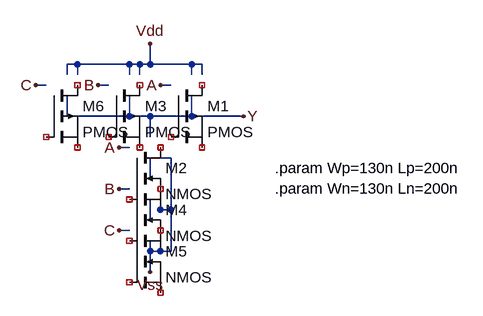
[diagram p0: schematic nand3.asc]
nand3.asc, the LTspice schematic file:
Version 4
SHEET 1 880 680
WIRE -272 -304 -288 -304
WIRE -192 -304 -272 -304
WIRE -176 -304 -192 -304
WIRE -160 -304 -160 -336
WIRE -160 -304 -176 -304
WIRE -96 -304 -160 -304
WIRE -80 -304 -96 -304
WIRE -288 -288 -288 -304
WIRE -272 -288 -272 -304
WIRE -192 -288 -192 -304
WIRE -176 -288 -176 -304
WIRE -96 -288 -96 -304
WIRE -80 -288 -80 -304
WIRE -320 -272 -336 -272
WIRE -224 -272 -240 -272
WIRE -128 -272 -144 -272
WIRE -288 -224 -288 -256
WIRE -192 -224 -192 -256
WIRE -192 -224 -288 -224
WIRE -160 -224 -192 -224
WIRE -96 -224 -96 -256
WIRE -96 -224 -160 -224
WIRE -16 -224 -96 -224
WIRE -160 -192 -160 -224
WIRE -192 -176 -208 -176
WIRE -128 -160 -144 -160
WIRE -160 -128 -160 -160
WIRE -192 -112 -208 -112
WIRE -144 -80 -144 -96
WIRE -128 -80 -128 -160
WIRE -128 -80 -144 -80
WIRE -160 -64 -160 -96
WIRE -192 -48 -208 -48
WIRE -160 -16 -160 -32
WIRE -144 -16 -144 -32
WIRE -144 -16 -160 -16
WIRE -128 -16 -128 -80
WIRE -128 -16 -144 -16
WIRE -160 16 -160 -16
FLAG -16 -224 Y
FLAG -144 -272 A
FLAG -160 16 Vss
FLAG -160 -336 Vdd
FLAG -208 -112 B
FLAG -208 -176 A
FLAG -240 -272 B
FLAG -208 -48 C
FLAG -336 -272 C
SYMBOL pmos -128 -272 R0
SYMATTR InstName M1
SYMATTR SpiceLine W={Wp} L={Lp}
SYMBOL nmos -192 -176 R0
SYMATTR InstName M2
SYMATTR SpiceLine W={Wn} L={Ln}
SYMBOL pmos -224 -272 R0
SYMATTR InstName M3
SYMATTR SpiceLine W={Wp} L={Lp}
SYMBOL nmos -192 -112 R0
SYMATTR InstName M4
SYMATTR SpiceLine W={Wn} L={Ln}
SYMBOL nmos -192 -48 R0
SYMATTR InstName M5
SYMATTR SpiceLine W={Wn} L={Ln}
SYMBOL pmos -320 -272 R0
SYMATTR InstName M6
SYMATTR SpiceLine W={Wp} L={Lp}
TEXT 32 -144 Left 2 !.param Wp=130n Lp=200n\n.param Wn=130n Ln=200n

The netlist it stands for:
* nand3.asc
* M1: PMOS W={Wp} L={Lp} (symbol pmos not certain, pin order unknown); nets seen at it: 
* M2: NMOS W={Wn} L={Ln} (symbol nmos not certain, pin order unknown); nets seen at it: Vss
* M3: PMOS W={Wp} L={Lp} (symbol pmos not certain, pin order unknown); nets seen at it: 
* M4: NMOS W={Wn} L={Ln} (symbol nmos not certain, pin order unknown); nets seen at it: Vss
* M5: NMOS W={Wn} L={Ln} (symbol nmos not certain, pin order unknown); nets seen at it: 
* M6: PMOS W={Wp} L={Lp} (symbol pmos not certain, pin order unknown); nets seen at it: 
.param Wp=130n Lp=200n
.param Wn=130n Ln=200n
.backanno
.end